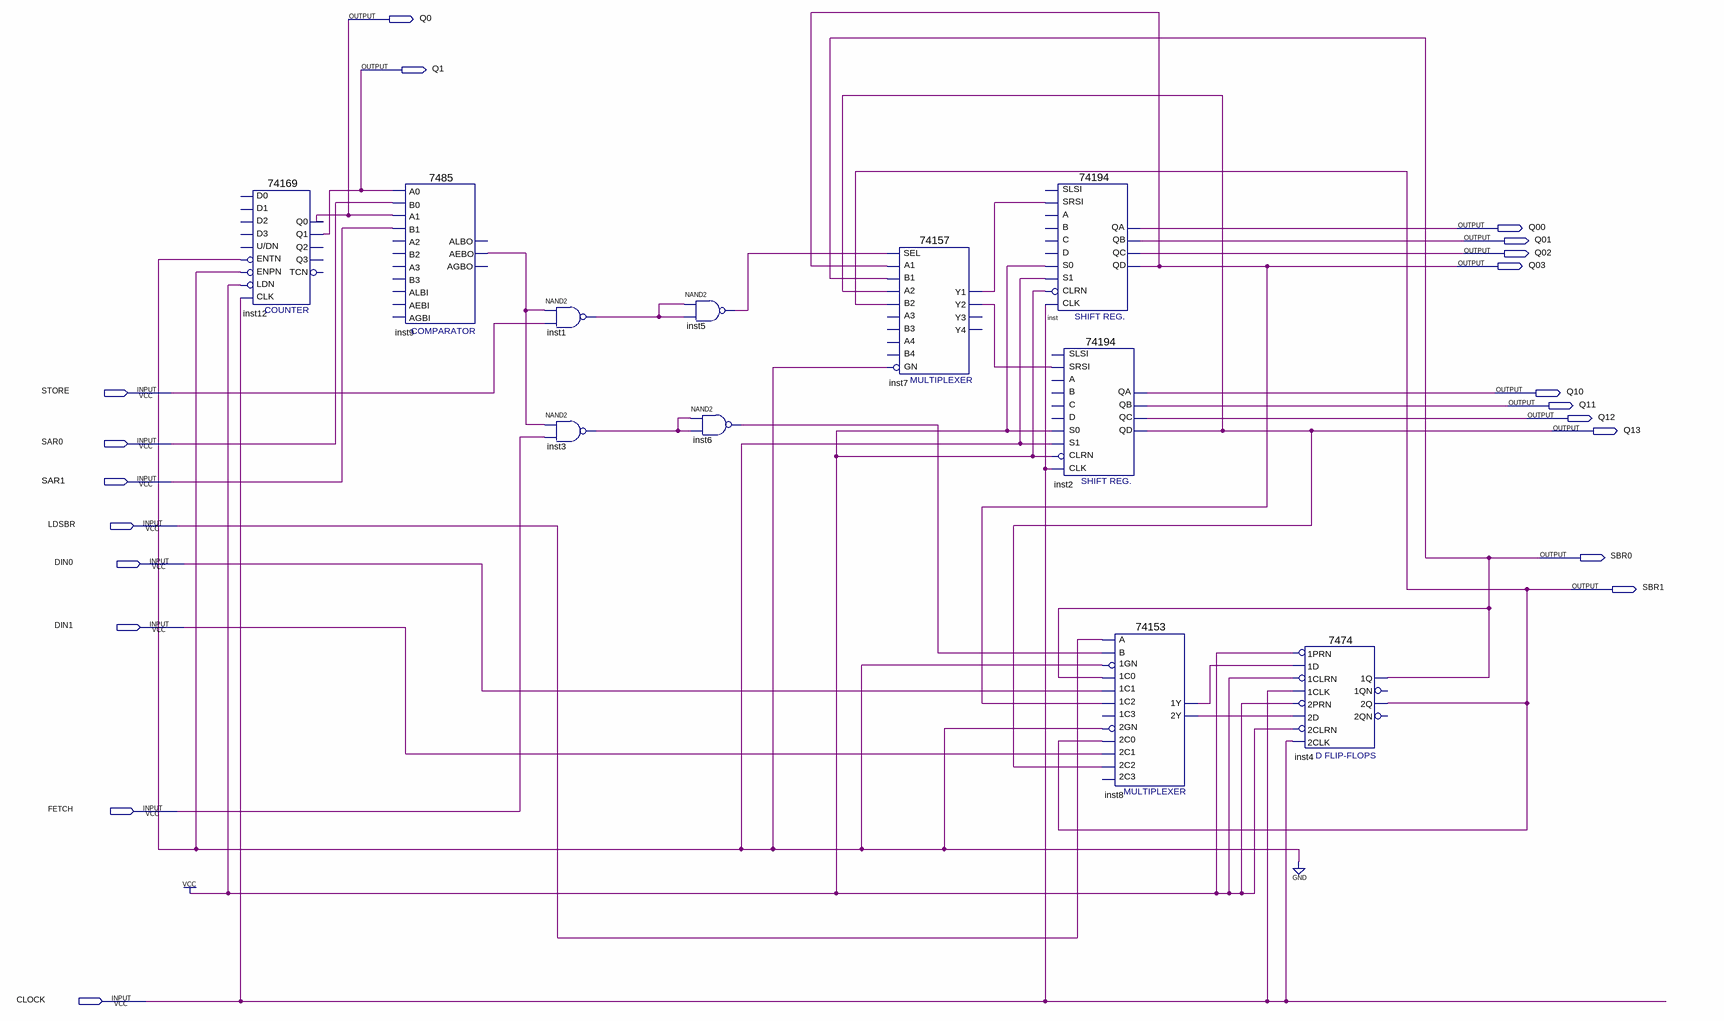
[diagram p0: schematic sheet]
// Quartus schematic lab2final.bdf as structural Verilog: 11 symbols, 20 pins
module lab2final (
  input  STORE,
  input  SAR0,
  input  SAR1,
  input  LDSBR,
  input  DIN0,
  input  DIN1,
  input  FETCH,
  input  CLOCK,
  output Q0,
  output Q1,
  output Q00,
  output Q01,
  output Q02,
  output Q03,
  output Q10,
  output Q11,
  output Q12,
  output Q13,
  output SBR0,
  output SBR1
);

  wire inst1_out, inst3_out, inst5_out, inst6_out, inst7_y1, inst7_y2, inst8_1y, inst8_2y, inst9_aebo;

  \74169  inst12 (
    .ENTN(1'b0), .LDN(1'b1), .CLK(CLOCK), .ENPN(1'b0), .Q1(Q1), .Q0(Q0));  // open: D1, D2, D0, U/DN, D3, Q2, TCN, Q3
  \7485  inst9 (
    .A0(Q1), .B0(SAR0), .A1(Q0), .B1(SAR1), .AEBO(inst9_aebo));  // open: A3, B2, A2, AEBI, AGBI, ALBI, B3, ALBO, AGBO
  nand inst1 (inst1_out, inst9_aebo, STORE);
  nand inst3 (inst3_out, inst9_aebo, FETCH);
  nand inst5 (inst5_out, inst1_out, inst1_out);
  nand inst6 (inst6_out, inst3_out, inst3_out);
  \74157  inst7 (
    .A1(Q03), .B1(SBR0), .SEL(inst5_out), .B2(SBR1), .A2(Q13), .GN(1'b0), .Y2(inst7_y2), .Y1(inst7_y1));  // open: A3, B3, B4, A4, Y4, Y3
  \74194  inst (
    .SRSI(inst7_y1), .CLK(CLOCK), .CLRN(1'b1), .S1(1'b0), .S0(1'b1), .QA(Q00), .QB(Q01), .QC(Q02), .QD(Q03));  // open: SLSI, B, C, D, A
  \74194  inst2 (
    .SRSI(inst7_y2), .CLK(CLOCK), .CLRN(1'b1), .S1(1'b0), .S0(1'b1), .QA(Q10), .QB(Q11), .QC(Q12), .QD(Q13));  // open: SLSI, B, C, D, A
  \74153  inst8 (
    .\1C1 (DIN0), .\1GN (1'b0), .\1C0 (SBR0), .\2C0 (SBR1), .\2GN (1'b0), .\2C2 (Q13), .\1C2 (Q03),
    .B(inst6_out), .A(LDSBR), .\2C1 (DIN1), .\1Y (inst8_1y), .\2Y (inst8_2y));  // open: 1C3, 2C3
  \7474  inst4 (
    .\2D (inst8_2y), .\2PRN (1'b1), .\1CLK (CLOCK), .\1D (inst8_1y), .\1PRN (1'b1), .\2CLK (CLOCK),
    .\2CLRN (1'b1), .\1CLRN (1'b1), .\2Q (SBR1), .\1Q (SBR0));  // open: 1QN, 2QN
endmodule
